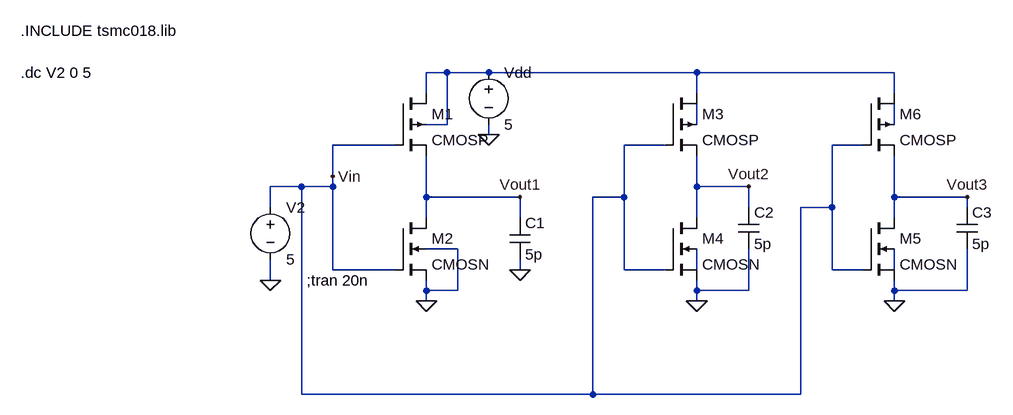
[diagram p0: schematic c2.asc]
c2.asc, the LTspice schematic file:
Version 4
SHEET 1 1364 680
WIRE 512 64 480 64
WIRE 576 64 512 64
WIRE 896 64 576 64
WIRE 1200 64 896 64
WIRE 480 96 480 64
WIRE 896 96 896 64
WIRE 1200 96 1200 64
WIRE 512 144 512 64
WIRE 512 144 480 144
WIRE 896 144 896 112
WIRE 1200 144 1200 112
WIRE 576 160 576 144
WIRE 432 176 336 176
WIRE 848 176 784 176
WIRE 1152 176 1104 176
WIRE 336 224 336 176
WIRE 288 240 240 240
WIRE 336 240 336 224
WIRE 336 240 288 240
WIRE 896 240 896 192
WIRE 976 240 896 240
WIRE 480 256 480 192
WIRE 624 256 480 256
WIRE 784 256 784 176
WIRE 784 256 736 256
WIRE 1200 256 1200 192
WIRE 1312 256 1200 256
WIRE 240 272 240 240
WIRE 976 272 976 240
WIRE 1104 272 1104 176
WIRE 1104 272 1056 272
WIRE 1312 272 1312 256
WIRE 480 288 480 256
WIRE 624 288 624 256
WIRE 896 288 896 240
WIRE 1200 288 1200 256
WIRE 528 336 480 336
WIRE 336 368 336 240
WIRE 432 368 336 368
WIRE 624 368 624 352
WIRE 784 368 784 256
WIRE 848 368 784 368
WIRE 896 368 896 336
WIRE 1104 368 1104 272
WIRE 1152 368 1104 368
WIRE 1200 368 1200 336
WIRE 240 384 240 352
WIRE 480 400 480 384
WIRE 528 400 528 336
WIRE 528 400 480 400
WIRE 896 400 896 384
WIRE 976 400 976 336
WIRE 976 400 896 400
WIRE 1200 400 1200 384
WIRE 1312 400 1312 336
WIRE 1312 400 1200 400
WIRE 480 416 480 400
WIRE 896 416 896 400
WIRE 1200 416 1200 400
WIRE 288 560 288 240
WIRE 736 560 736 256
WIRE 736 560 288 560
WIRE 1056 560 1056 272
WIRE 1056 560 736 560
FLAG 480 416 0
FLAG 576 160 0
FLAG 240 384 0
FLAG 624 368 0
FLAG 336 224 Vin
FLAG 624 256 Vout1
FLAG 1200 416 0
FLAG 896 416 0
FLAG 976 240 Vout2
FLAG 1312 256 Vout3
SYMBOL cmosp 432 96 R0
SYMATTR InstName M1
SYMATTR Value2 l=180n w=800n
SYMBOL cmosn 432 288 R0
SYMATTR InstName M2
SYMATTR Value2 l=180n w=400n
SYMBOL voltage 576 48 R0
SYMATTR InstName Vdd
SYMATTR Value 5
SYMBOL voltage 240 256 R0
WINDOW 123 0 0 Left 0
WINDOW 39 0 0 Left 0
SYMATTR InstName V2
SYMATTR Value 5
SYMBOL cap 608 288 R0
SYMATTR InstName C1
SYMATTR Value 5p
SYMBOL cmosn 848 288 R0
SYMATTR InstName M4
SYMATTR Value2 l=180n w=400n
SYMBOL cmosn 1152 288 R0
SYMATTR InstName M5
SYMATTR Value2 l=180n w=400n
SYMBOL cmosp 1152 96 R0
SYMATTR InstName M6
SYMATTR Value2 l=180n w=3200n
SYMBOL cap 960 272 R0
SYMATTR InstName C2
SYMATTR Value 5p
SYMBOL cap 1296 272 R0
SYMATTR InstName C3
SYMATTR Value 5p
SYMBOL cmosp 848 96 R0
SYMATTR InstName M3
SYMATTR Value2 l=180n w=1600n
TEXT -144 0 Left 2 !.INCLUDE tsmc018.lib
TEXT -144 64 Left 2 !.dc V2 0 5
TEXT 296 384 Left 2 !;tran 20n

The netlist it stands for:
* c2.asc
M1 N001 Vin Vout1 N001 CMOSP l=180n w=800n
M2 Vout1 Vin 0 0 CMOSN l=180n w=400n
Vdd N001 0 5
V2 Vin 0 5
C1 Vout1 0 5p
M4 Vout2 Vin 0 N004 CMOSN l=180n w=400n
M5 Vout3 Vin 0 N005 CMOSN l=180n w=400n
M6 N001 Vin Vout3 N003 CMOSP l=180n w=3200n
C2 Vout2 0 5p
C3 Vout3 0 5p
M3 N001 Vin Vout2 N002 CMOSP l=180n w=1600n
.model NMOS NMOS
.model PMOS PMOS
.lib standard.mos
.INCLUDE tsmc018.lib
.dc V2 0 5
;tran 20n
.backanno
.end